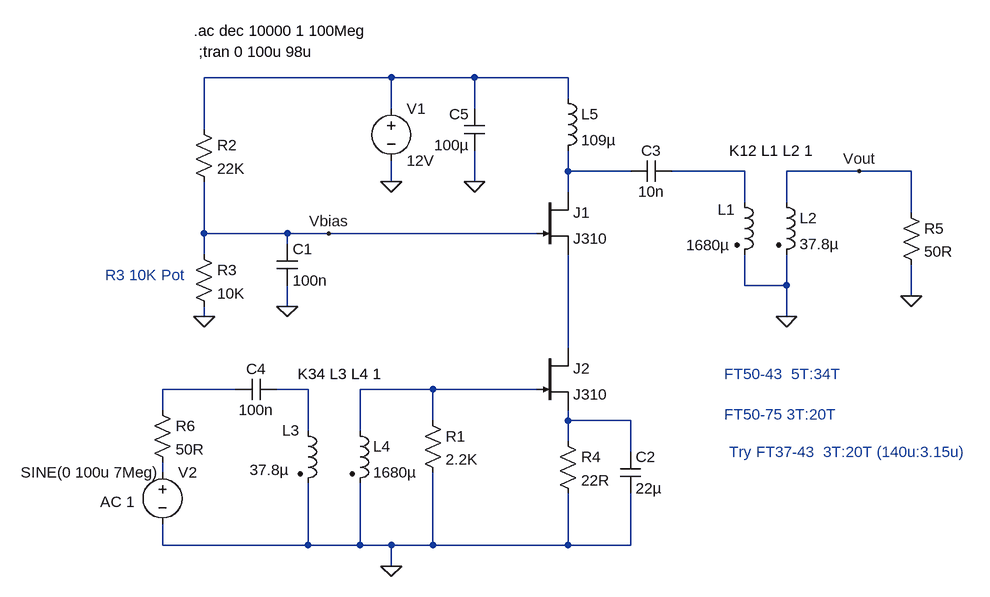
[diagram p0: schematic J310 RF AMP.asc]
J310 RF AMP.asc, the LTspice schematic file:
Version 4
SHEET 1 944 680
WIRE 0 -144 -288 -144
WIRE 128 -144 0 -144
WIRE 272 -144 128 -144
WIRE 272 -112 272 -144
WIRE 0 -96 0 -144
WIRE 128 -96 128 -144
WIRE -288 -64 -288 -144
WIRE 272 0 272 -32
WIRE 368 0 272 0
WIRE 544 0 432 0
WIRE 720 0 608 0
WIRE 800 0 720 0
WIRE 0 16 0 -16
WIRE 128 16 128 -32
WIRE 272 32 272 0
WIRE 544 48 544 0
WIRE 608 48 608 0
WIRE 800 64 800 0
WIRE -288 96 -288 16
WIRE -160 96 -288 96
WIRE -96 96 -160 96
WIRE 224 96 -96 96
WIRE -160 112 -160 96
WIRE -288 128 -288 96
WIRE 544 176 544 128
WIRE 608 176 608 128
WIRE 608 176 544 176
WIRE 800 192 800 144
WIRE -160 208 -160 176
WIRE -288 224 -288 208
WIRE 608 224 608 176
WIRE 272 272 272 128
WIRE -240 336 -352 336
WIRE -128 336 -176 336
WIRE 64 336 -48 336
WIRE 224 336 64 336
WIRE -352 368 -352 336
WIRE 64 384 64 336
WIRE 272 384 272 368
WIRE 368 384 272 384
WIRE -128 400 -128 336
WIRE -48 400 -48 336
WIRE 272 416 272 384
WIRE 368 432 368 384
WIRE -352 464 -352 448
WIRE -352 576 -352 544
WIRE -128 576 -128 480
WIRE -128 576 -352 576
WIRE -48 576 -48 480
WIRE -48 576 -128 576
WIRE 0 576 -48 576
WIRE 64 576 64 464
WIRE 64 576 0 576
WIRE 272 576 272 496
WIRE 272 576 64 576
WIRE 368 576 368 496
WIRE 368 576 272 576
WIRE 0 608 0 576
FLAG 128 16 0
FLAG 0 16 0
FLAG 608 224 0
FLAG 0 608 0
FLAG -288 224 0
FLAG -160 208 0
FLAG 800 192 0
FLAG 720 0 Vout
FLAG -96 96 Vbias
SYMBOL voltage 0 -112 R0
WINDOW 123 0 0 Left 2
WINDOW 39 0 0 Left 2
SYMATTR InstName V1
SYMATTR Value 12V
SYMBOL voltage -352 448 R0
WINDOW 3 -218 16 Left 2
WINDOW 123 -96 61 Left 2
WINDOW 39 0 0 Left 2
SYMATTR Value SINE(0 100u 7Meg)
SYMATTR Value2 AC 1
SYMATTR InstName V2
SYMBOL ind2 528 32 R0
WINDOW 0 -26 27 Left 2
WINDOW 3 -74 82 Left 2
SYMATTR InstName L1
SYMATTR Value 1680µ
SYMATTR Type ind
SYMBOL ind2 592 32 R0
SYMATTR InstName L2
SYMATTR Value 37.8µ
SYMATTR Type ind
SYMBOL ind2 -144 384 R0
WINDOW 0 -24 15 Left 2
WINDOW 3 -74 76 Left 2
SYMATTR InstName L3
SYMATTR Value 37.8µ
SYMATTR Type ind
SYMBOL ind2 -64 384 R0
SYMATTR InstName L4
SYMATTR Value 1680µ
SYMATTR Type ind
SYMBOL res 48 368 R0
SYMATTR InstName R1
SYMATTR Value 2.2K
SYMBOL res -304 -80 R0
SYMATTR InstName R2
SYMATTR Value 22K
SYMBOL res -304 112 R0
SYMATTR InstName R3
SYMATTR Value 10K
SYMBOL cap -176 112 R0
SYMATTR InstName C1
SYMATTR Value 100n
SYMBOL ind 256 -128 R0
SYMATTR InstName L5
SYMATTR Value 109µ
SYMBOL res 256 400 R0
SYMATTR InstName R4
SYMATTR Value 22R
SYMBOL res 784 48 R0
SYMATTR InstName R5
SYMATTR Value 50R
SYMBOL cap 352 432 R0
SYMATTR InstName C2
SYMATTR Value 22µ
SYMBOL cap 432 -16 R90
WINDOW 0 0 32 VBottom 2
WINDOW 3 32 32 VTop 2
SYMATTR InstName C3
SYMATTR Value 10n
SYMBOL cap -176 320 R90
WINDOW 0 0 32 VBottom 2
WINDOW 3 32 32 VTop 2
SYMATTR InstName C4
SYMATTR Value 100n
SYMBOL cap 144 -32 R180
WINDOW 0 24 56 Left 2
WINDOW 3 24 8 Left 2
SYMATTR InstName C5
SYMATTR Value 100µ
SYMBOL res -368 352 R0
SYMATTR InstName R6
SYMATTR Value 50R
SYMBOL njf 224 32 R0
SYMATTR InstName J1
SYMATTR Value J310
SYMBOL njf 224 272 R0
SYMATTR InstName J2
SYMATTR Value J310
TEXT -144 312 Left 2 !K34 L3 L4 1
TEXT 520 -32 Left 2 !K12 L1 L2 1
TEXT -296 -184 Left 2 !;tran 0 100u 98u
TEXT -304 -216 Left 2 !.ac dec 10000 1 100Meg
TEXT -440 160 Left 2 ;R3 10K Pot
TEXT 512 312 Left 2 ;FT50-43  5T:34T\n \nFT50-75 3T:20T
TEXT 520 432 Left 2 ;Try FT37-43  3T:20T (140u:3.15u)

The netlist it stands for:
* J310 RF AMP.asc
V1 N001 0 12V
V2 N009 0 SINE(0 100u 7Meg) AC 1
L1 N003 0 1680µ
L2 Vout 0 37.8µ
L3 N006 0 37.8µ
L4 N007 0 1680µ
R1 N007 0 2.2K
R2 N001 Vbias 22K
R3 Vbias 0 10K
C1 Vbias 0 100n
L5 N001 N002 109µ
R4 N008 0 22R
R5 Vout 0 50R
C2 N008 0 22µ
C3 N003 N002 10n
C4 N006 N005 100n
C5 0 N001 100µ
R6 N005 N009 50R
J1 N002 Vbias N004 J310
J2 N004 N007 N008 J310
.model NJF NJF
.model PJF PJF
.lib standard.jft
K34 L3 L4 1
K12 L1 L2 1
;tran 0 100u 98u
.ac dec 10000 1 100Meg
* R3 10K Pot
* FT50-43  5T:34T
* FT50-75 3T:20T
* Try FT37-43  3T:20T (140u:3.15u)
.backanno
.end